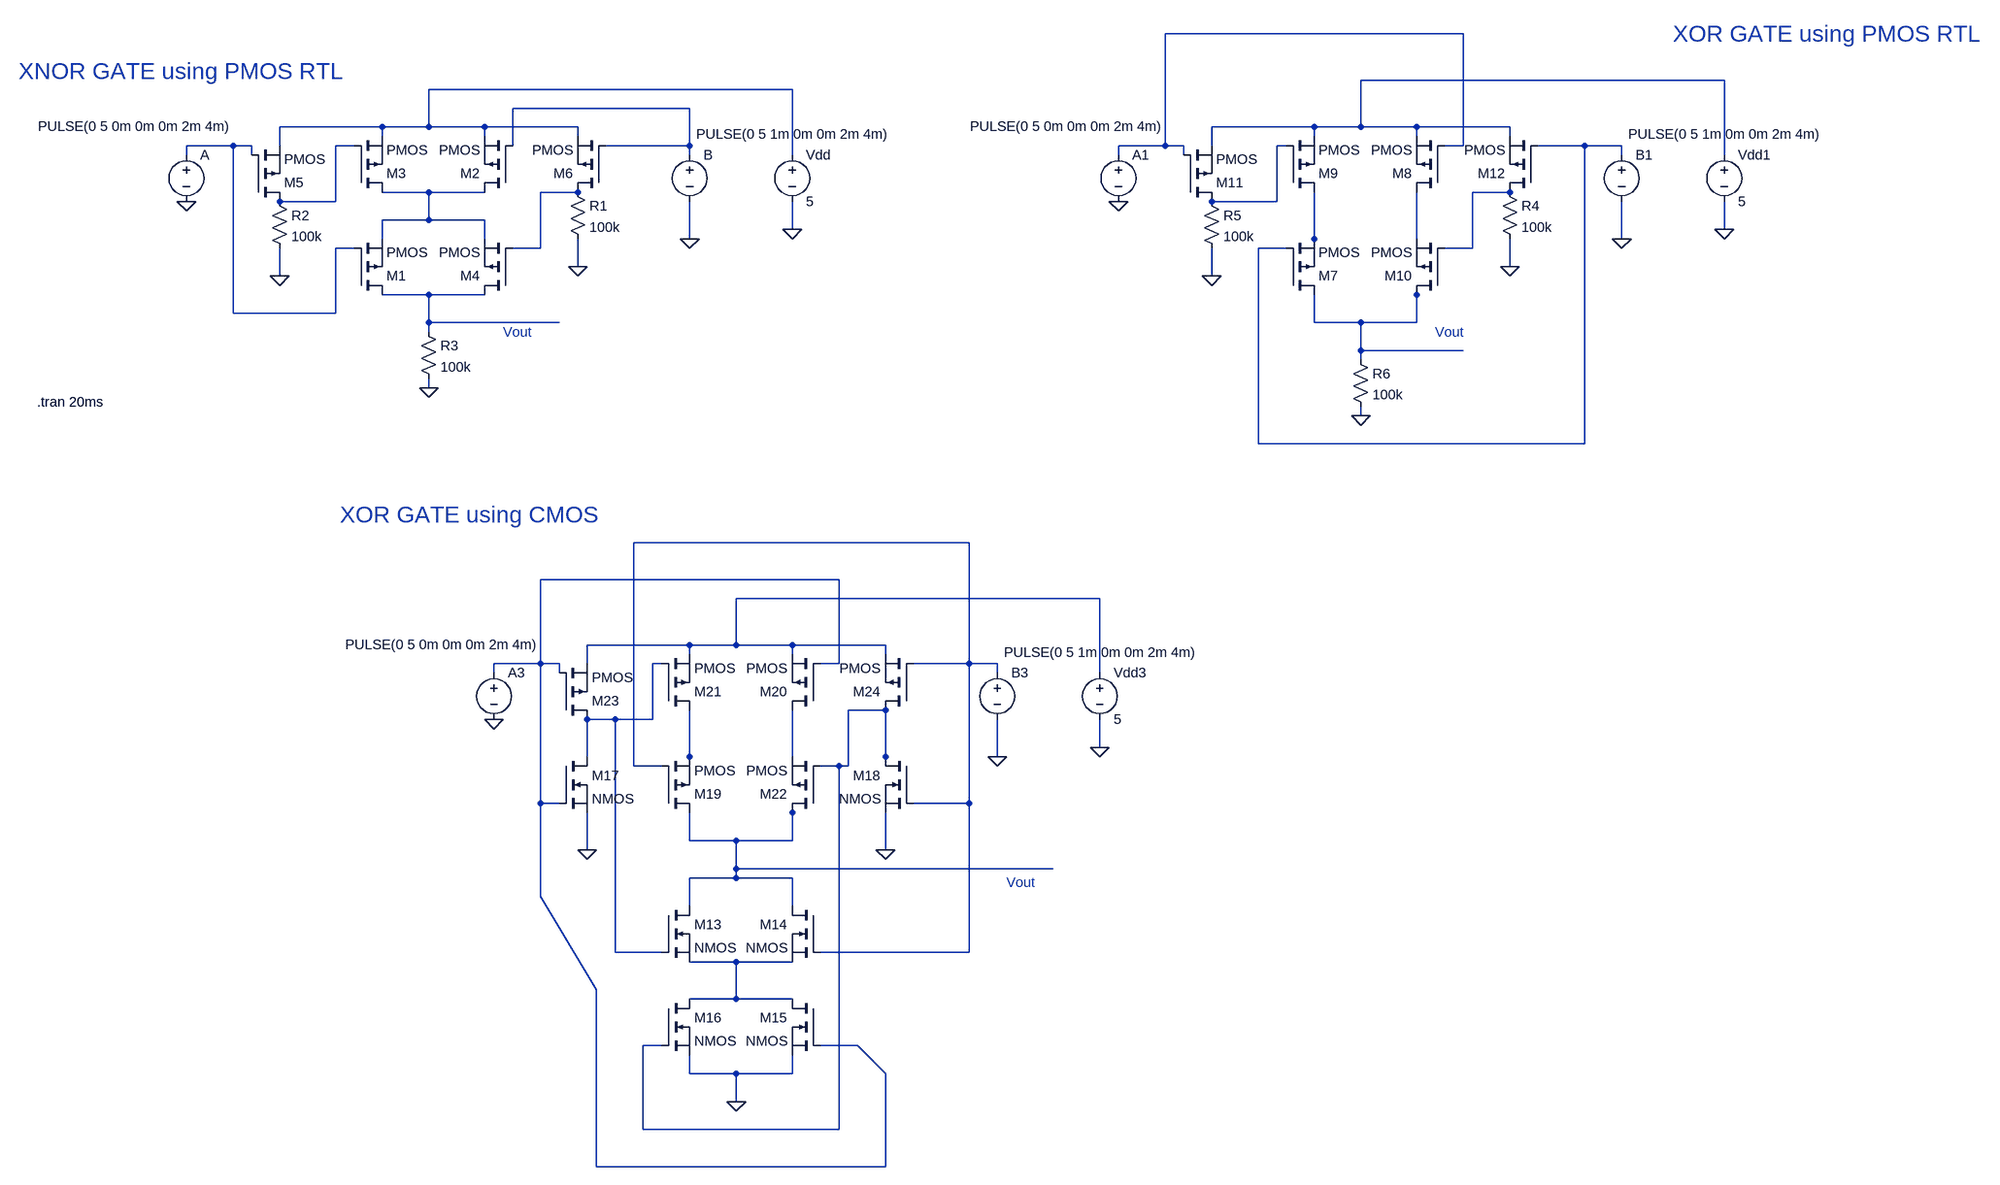
[diagram p0: schematic CMOS vs PMOS.asc]
CMOS vs PMOS.asc, the LTspice schematic file:
Version 4.1
SHEET 1 3080 1860
WIRE 2192 -128 1680 -128
WIRE 2640 -48 2016 -48
WIRE 1040 -32 416 -32
WIRE 864 0 560 0
WIRE 336 32 160 32
WIRE 416 32 416 -32
WIRE 416 32 336 32
WIRE 512 32 416 32
WIRE 672 32 512 32
WIRE 1936 32 1760 32
WIRE 2016 32 2016 -48
WIRE 2016 32 1936 32
WIRE 2112 32 2016 32
WIRE 2272 32 2112 32
WIRE 336 48 336 32
WIRE 512 48 512 32
WIRE 672 48 672 32
WIRE 1936 48 1936 32
WIRE 2112 48 2112 32
WIRE 2272 48 2272 32
WIRE 80 64 0 64
WIRE 112 64 80 64
WIRE 160 64 160 32
WIRE 288 64 256 64
WIRE 560 64 560 0
WIRE 864 64 864 0
WIRE 864 64 720 64
WIRE 1680 64 1680 -128
WIRE 1680 64 1600 64
WIRE 1712 64 1680 64
WIRE 1760 64 1760 32
WIRE 1888 64 1872 64
WIRE 2192 64 2192 -128
WIRE 2192 64 2160 64
WIRE 2400 64 2320 64
WIRE 2464 64 2400 64
WIRE 0 80 0 64
WIRE 112 80 112 64
WIRE 864 80 864 64
WIRE 1040 80 1040 -32
WIRE 1600 80 1600 64
WIRE 1712 80 1712 64
WIRE 2464 80 2464 64
WIRE 2640 80 2640 -48
WIRE 416 144 336 144
WIRE 512 144 416 144
WIRE 672 144 608 144
WIRE 2272 144 2208 144
WIRE 256 160 256 64
WIRE 256 160 160 160
WIRE 1872 160 1872 64
WIRE 1872 160 1760 160
WIRE 416 192 416 144
WIRE 416 192 336 192
WIRE 512 192 416 192
WIRE 1040 208 1040 160
WIRE 2640 208 2640 160
WIRE 336 224 336 192
WIRE 512 224 512 192
WIRE 864 224 864 160
WIRE 1936 224 1936 144
WIRE 2112 224 2112 144
WIRE 2464 224 2464 160
WIRE 288 240 256 240
WIRE 608 240 608 144
WIRE 608 240 560 240
WIRE 1888 240 1840 240
WIRE 1936 240 1936 224
WIRE 2208 240 2208 144
WIRE 2208 240 2160 240
WIRE 672 272 672 224
WIRE 2272 272 2272 224
WIRE 160 288 160 240
WIRE 1760 288 1760 240
WIRE 416 320 336 320
WIRE 512 320 416 320
WIRE 2112 320 2112 304
WIRE 80 352 80 64
WIRE 256 352 256 240
WIRE 256 352 80 352
WIRE 416 368 416 320
WIRE 640 368 416 368
WIRE 1936 368 1936 320
WIRE 2016 368 1936 368
WIRE 2112 368 2112 320
WIRE 2112 368 2016 368
WIRE 416 384 416 368
WIRE 2016 416 2016 368
WIRE 2192 416 2016 416
WIRE 2016 432 2016 416
WIRE 416 480 416 464
WIRE 2016 528 2016 512
WIRE 1840 576 1840 240
WIRE 2400 576 2400 64
WIRE 2400 576 1840 576
WIRE 1344 784 768 784
WIRE 1120 848 608 848
WIRE 1568 880 944 880
WIRE 864 960 688 960
WIRE 944 960 944 880
WIRE 944 960 864 960
WIRE 1040 960 944 960
WIRE 1200 960 1040 960
WIRE 864 976 864 960
WIRE 1040 976 1040 960
WIRE 1200 976 1200 960
WIRE 608 992 608 848
WIRE 608 992 528 992
WIRE 640 992 608 992
WIRE 688 992 688 960
WIRE 816 992 800 992
WIRE 1120 992 1120 848
WIRE 1120 992 1088 992
WIRE 1344 992 1344 784
WIRE 1344 992 1248 992
WIRE 1392 992 1344 992
WIRE 528 1008 528 992
WIRE 640 1008 640 992
WIRE 1392 1008 1392 992
WIRE 1568 1008 1568 880
WIRE 1200 1072 1136 1072
WIRE 736 1088 688 1088
WIRE 800 1088 800 992
WIRE 800 1088 736 1088
WIRE 1568 1136 1568 1088
WIRE 688 1152 688 1088
WIRE 864 1152 864 1072
WIRE 1040 1152 1040 1072
WIRE 1200 1152 1200 1072
WIRE 1392 1152 1392 1088
WIRE 768 1168 768 784
WIRE 816 1168 768 1168
WIRE 864 1168 864 1152
WIRE 1120 1168 1088 1168
WIRE 1136 1168 1136 1072
WIRE 1136 1168 1120 1168
WIRE 1200 1168 1200 1152
WIRE 608 1232 608 992
WIRE 640 1232 608 1232
WIRE 1344 1232 1344 992
WIRE 1344 1232 1248 1232
WIRE 1040 1248 1040 1232
WIRE 864 1296 864 1248
WIRE 944 1296 864 1296
WIRE 1040 1296 1040 1248
WIRE 1040 1296 944 1296
WIRE 688 1312 688 1248
WIRE 1200 1312 1200 1248
WIRE 944 1344 944 1296
WIRE 1488 1344 944 1344
WIRE 944 1360 944 1344
WIRE 944 1360 864 1360
WIRE 1040 1360 944 1360
WIRE 608 1392 608 1232
WIRE 864 1408 864 1360
WIRE 1040 1408 1040 1360
WIRE 736 1488 736 1088
WIRE 816 1488 736 1488
WIRE 1344 1488 1344 1232
WIRE 1344 1488 1088 1488
WIRE 944 1504 864 1504
WIRE 1040 1504 944 1504
WIRE 704 1552 608 1392
WIRE 944 1568 944 1504
WIRE 944 1568 864 1568
WIRE 1040 1568 944 1568
WIRE 816 1648 784 1648
WIRE 1152 1648 1088 1648
WIRE 864 1696 864 1664
WIRE 944 1696 864 1696
WIRE 1040 1696 1040 1664
WIRE 1040 1696 944 1696
WIRE 1200 1696 1152 1648
WIRE 944 1744 944 1696
WIRE 784 1792 784 1648
WIRE 1120 1792 1120 1168
WIRE 1120 1792 784 1792
WIRE 704 1856 704 1552
WIRE 1200 1856 1200 1696
WIRE 1200 1856 704 1856
FLAG 160 288 0
FLAG 672 272 0
FLAG 0 160 0
FLAG 416 480 0
FLAG 864 224 0
FLAG 1040 208 0
FLAG 1760 288 0
FLAG 2272 272 0
FLAG 1600 160 0
FLAG 2016 528 0
FLAG 2464 224 0
FLAG 2640 208 0
FLAG 528 1088 0
FLAG 1392 1152 0
FLAG 1568 1136 0
FLAG 688 1312 0
FLAG 1200 1312 0
FLAG 944 1744 0
SYMBOL pmos 288 320 M180
SYMATTR InstName M1
SYMBOL pmos 560 144 R180
SYMATTR InstName M2
SYMBOL pmos 288 144 M180
SYMATTR InstName M3
SYMBOL pmos 560 320 R180
SYMATTR InstName M4
SYMBOL pmos 112 160 M180
SYMATTR InstName M5
SYMBOL voltage 864 64 R0
WINDOW 3 177 -35 Top 2
WINDOW 123 0 0 Left 0
WINDOW 39 0 0 Left 0
SYMATTR InstName B
SYMATTR Value PULSE(0 5 1m 0m 0m 2m 4m)
SYMBOL voltage 0 64 R0
WINDOW 3 -255 -33 Left 2
WINDOW 123 0 0 Left 0
WINDOW 39 0 0 Left 0
SYMATTR InstName A
SYMATTR Value PULSE(0 5 0m 0m 0m 2m 4m)
SYMBOL voltage 1040 64 R0
WINDOW 123 0 0 Left 0
WINDOW 39 0 0 Left 0
SYMATTR InstName Vdd
SYMATTR Value 5
SYMBOL res 656 128 R0
SYMATTR InstName R1
SYMATTR Value 100k
SYMBOL res 144 144 R0
SYMATTR InstName R2
SYMATTR Value 100k
SYMBOL pmos 720 144 R180
SYMATTR InstName M6
SYMBOL res 400 368 R0
SYMATTR InstName R3
SYMATTR Value 100k
SYMBOL pmos 1888 320 M180
SYMATTR InstName M7
SYMBOL pmos 2160 144 R180
SYMATTR InstName M8
SYMBOL pmos 1888 144 M180
SYMATTR InstName M9
SYMBOL pmos 2160 320 R180
SYMATTR InstName M10
SYMBOL pmos 1712 160 M180
SYMATTR InstName M11
SYMBOL voltage 2464 64 R0
WINDOW 3 177 -35 Top 2
WINDOW 123 0 0 Left 0
WINDOW 39 0 0 Left 0
SYMATTR InstName B1
SYMATTR Value PULSE(0 5 1m 0m 0m 2m 4m)
SYMBOL voltage 1600 64 R0
WINDOW 3 -255 -33 Left 2
WINDOW 123 0 0 Left 0
WINDOW 39 0 0 Left 0
SYMATTR InstName A1
SYMATTR Value PULSE(0 5 0m 0m 0m 2m 4m)
SYMBOL voltage 2640 64 R0
WINDOW 123 0 0 Left 0
WINDOW 39 0 0 Left 0
SYMATTR InstName Vdd1
SYMATTR Value 5
SYMBOL res 2256 128 R0
SYMATTR InstName R4
SYMATTR Value 100k
SYMBOL res 1744 144 R0
SYMATTR InstName R5
SYMATTR Value 100k
SYMBOL pmos 2320 144 R180
SYMATTR InstName M12
SYMBOL res 2000 416 R0
SYMATTR InstName R6
SYMATTR Value 100k
SYMBOL pmos 816 1248 M180
SYMATTR InstName M19
SYMBOL pmos 1088 1072 R180
SYMATTR InstName M20
SYMBOL pmos 816 1072 M180
SYMATTR InstName M21
SYMBOL pmos 1088 1248 R180
SYMATTR InstName M22
SYMBOL pmos 640 1088 M180
SYMATTR InstName M23
SYMBOL voltage 1392 992 R0
WINDOW 3 177 -35 Top 2
WINDOW 123 0 0 Left 0
WINDOW 39 0 0 Left 0
SYMATTR InstName B3
SYMATTR Value PULSE(0 5 1m 0m 0m 2m 4m)
SYMBOL voltage 528 992 R0
WINDOW 3 -255 -33 Left 2
WINDOW 123 0 0 Left 0
WINDOW 39 0 0 Left 0
SYMATTR InstName A3
SYMATTR Value PULSE(0 5 0m 0m 0m 2m 4m)
SYMBOL voltage 1568 992 R0
WINDOW 123 0 0 Left 0
WINDOW 39 0 0 Left 0
SYMATTR InstName Vdd3
SYMATTR Value 5
SYMBOL pmos 1248 1072 R180
SYMATTR InstName M24
SYMBOL nmos 816 1408 R0
SYMATTR InstName M13
SYMBOL nmos 1088 1408 M0
SYMATTR InstName M14
SYMBOL nmos 1088 1568 M0
SYMATTR InstName M15
SYMBOL nmos 816 1568 R0
SYMATTR InstName M16
SYMBOL nmos 640 1152 R0
SYMATTR InstName M17
SYMBOL nmos 1248 1152 M0
SYMATTR InstName M18
TEXT 544 384 Left 2 ;Vout
TEXT -256 504 Left 2 !.tran 20ms
TEXT 2144 384 Left 2 ;Vout
TEXT 1408 1368 Left 2 ;Vout
TEXT -288 -64 Left 4 ;XNOR GATE using PMOS RTL
TEXT 2552 -128 Left 4 ;XOR GATE using PMOS RTL
TEXT 264 736 Left 4 ;XOR GATE using CMOS

The netlist it stands for:
* CMOS vs PMOS.asc
M1 N014 N005 N009 N009 PMOS
M2 N009 N004 N003 N003 PMOS
M3 N009 N006 N003 N003 PMOS
M4 N014 N010 N009 N009 PMOS
M5 N006 N005 N003 N003 PMOS
V§B N004 0 PULSE(0 5 1m 0m 0m 2m 4m)
V§A N005 0 PULSE(0 5 0m 0m 0m 2m 4m)
Vdd N003 0 5
R1 N010 0 100k
R2 N006 0 100k
M6 N010 N004 N003 N003 PMOS
R3 N014 0 100k
M7 N015 N008 N012 N012 PMOS
M8 N013 N001 N002 N002 PMOS
M9 N012 N007 N002 N002 PMOS
M10 N015 N011 N013 N013 PMOS
M11 N007 N001 N002 N002 PMOS
V§B1 N008 0 PULSE(0 5 1m 0m 0m 2m 4m)
V§A1 N001 0 PULSE(0 5 0m 0m 0m 2m 4m)
Vdd1 N002 0 5
R4 N011 0 100k
R5 N007 0 100k
M12 N011 N008 N002 N002 PMOS
R6 N015 0 100k
M19 N023 N016 N021 N021 PMOS
M20 N022 N017 N018 N018 PMOS
M21 N021 N019 N018 N018 PMOS
M22 N023 N020 N022 N022 PMOS
M23 N019 N017 N018 N018 PMOS
V§B3 N016 0 PULSE(0 5 1m 0m 0m 2m 4m)
V§A3 N017 0 PULSE(0 5 0m 0m 0m 2m 4m)
Vdd3 N018 0 5
M24 N020 N016 N018 N018 PMOS
M13 N023 N019 N024 N024 NMOS
M14 N023 N016 N024 N024 NMOS
M15 N024 N017 0 0 NMOS
M16 N024 N020 0 0 NMOS
M17 N019 N017 0 0 NMOS
M18 N020 N016 0 0 NMOS
.model NMOS NMOS
.model PMOS PMOS
.lib standard.mos
* Vout
.tran 20ms
* Vout
* Vout
* XNOR GATE using PMOS RTL
* XOR GATE using PMOS RTL
* XOR GATE using CMOS
.backanno
.end